# EasyEDA schematic Schematic.json
TITLE: Arduboy Clone; REV: 1.0; Date: 2017-06-03; Sheet: 1/1; Drawn By: Amal Shajan
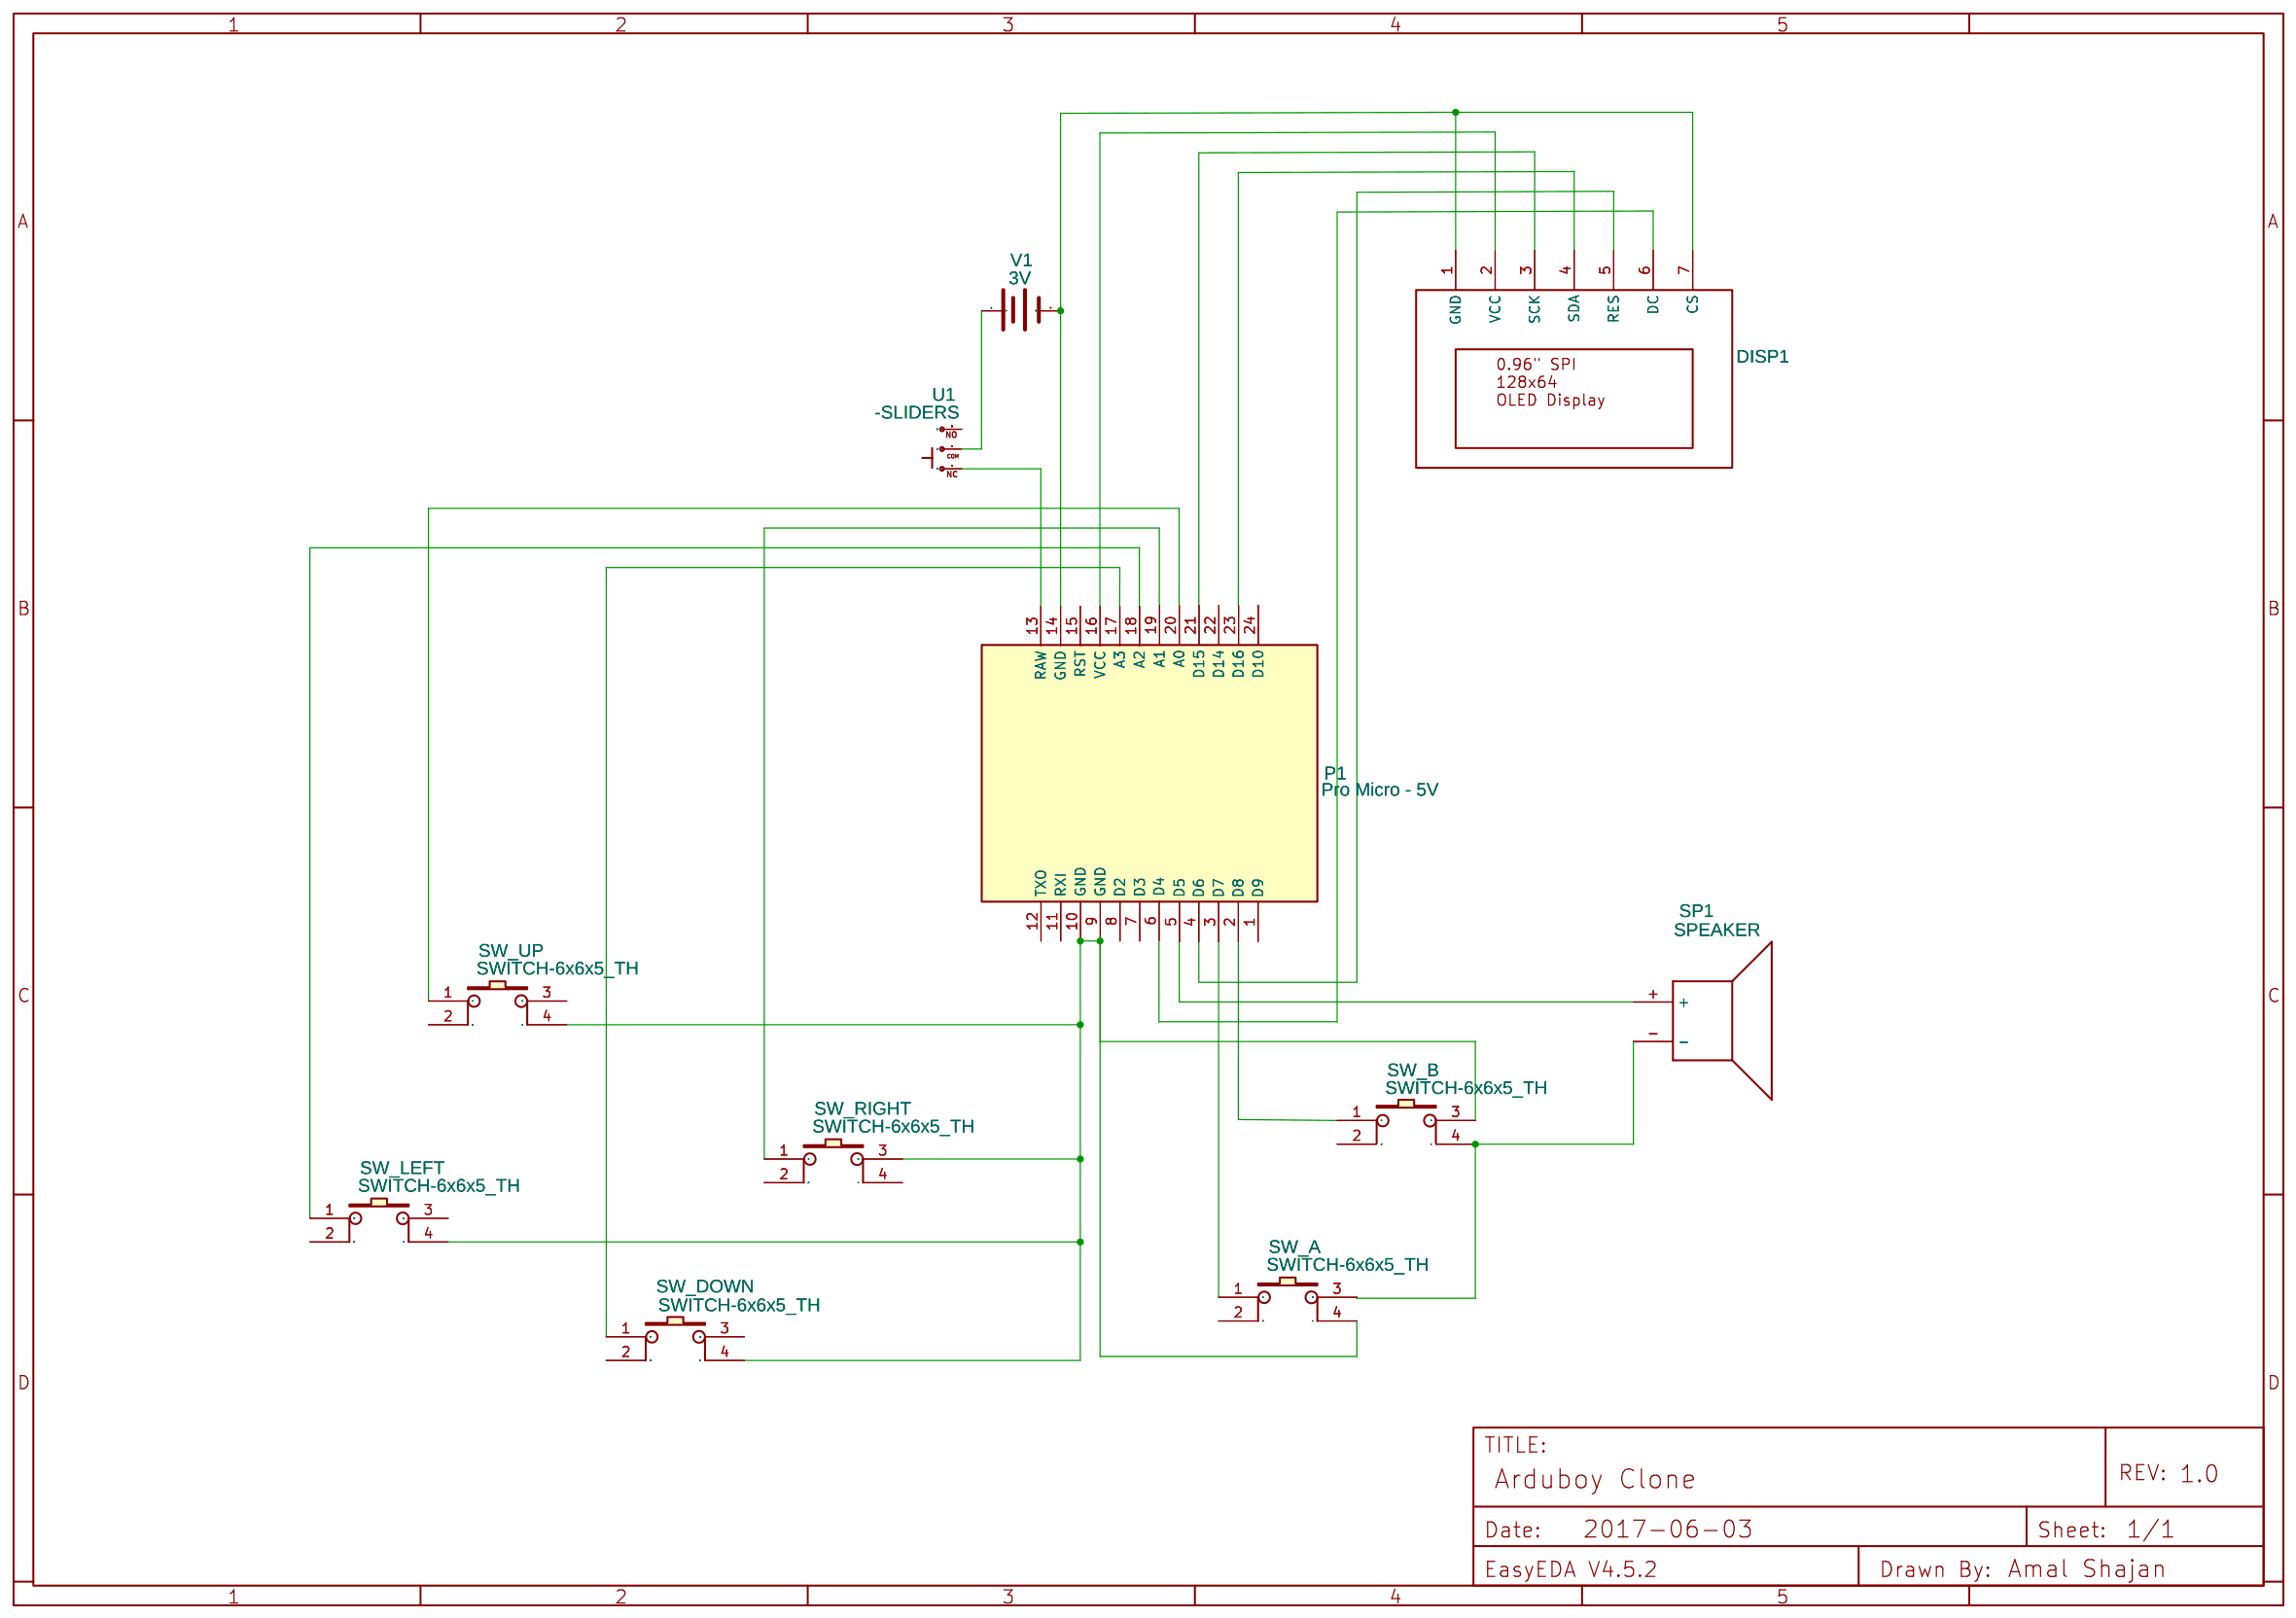
[diagram p0: schematic sheet]

## Parts
DISP1  NO  [7pin SPI color OLED Display]
P1  Pro Micro - 5V  [Pro Micro - 5V]
SP1  SPEAKER  [PCB_MOUNT_SPEAKER]
SW_A  SWITCH-6x6x5_TH  [SWITCH-12X12X7.3_DIP]
SW_B  SWITCH-6x6x5_TH  [SWITCH-12X12X7.3_DIP]
SW_DOWN  SWITCH-6x6x5_TH  [SWITCH-12X12X7.3_DIP]
SW_LEFT  SWITCH-6x6x5_TH  [SWITCH-12X12X7.3_DIP]
SW_RIGHT  SWITCH-6x6x5_TH  [SWITCH-12X12X7.3_DIP]
SW_UP  SWITCH-6x6x5_TH  [SWITCH-12X12X7.3_DIP]
U1  -SLIDERS  [CON3]
V1  3V  [BATTERY-1]

## Library data of the parts
DISP1 = -: Contributor: gerdmuller.de; sourceId: YwIUSP1BN; Manufacturer Part: ?
P1 = -: catid: 20; sourceId: 1T5FDZYC8; Manufacturer Part: ?
SP1 = -: catid: 20; Contributor: SparkFun; Manufacturer Part: ?
SW_A SW_B SW_DOWN SW_LEFT SW_RIGHT SW_UP = -: EasyEDA: C69330; Supplier: EasyEDA; Manufacturer: EasyEDA
U1 = -: catid: 20; Manufacturer Part: ?
V1 = Battery: Manufacturer Part: ?

## Nets
Net-(DISP1-1): DISP1.1(GND) DISP1.7(CS) P1.14(GND) V1.2
Net-(DISP1-2): DISP1.2(VCC) P1.16(VCC)
Net-(DISP1-3): DISP1.3(SCK) P1.21(D15)
Net-(DISP1-4): DISP1.4(SDA) P1.23(D16)
Net-(DISP1-5): DISP1.5(RES) P1.4(D6)
Net-(DISP1-6): DISP1.6(DC) P1.6(D4)
Net-(P1-2): P1.2(D8) SW_B.1
Net-(P1-3): P1.3(D7) SW_A.1
Net-(P1-5): P1.5(D5) SP1.+
Net-(P1-9): P1.9(GND) P1.10(GND) SW_A.4 SW_B.3 SW_DOWN.4 SW_LEFT.4 SW_RIGHT.3 SW_UP.4
Net-(P1-13): P1.13(RAW) U1.P$1(1)
Net-(P1-17): P1.17(A3) SW_DOWN.1
Net-(P1-18): P1.18(A2) SW_LEFT.1
Net-(P1-19): P1.19(A1) SW_RIGHT.1
Net-(P1-20): P1.20(A0) SW_UP.1
Net-(SP1--): SP1.- SW_A.3 SW_B.4
Net-(U1-P$2): U1.P$2(2) V1.1

Not connected (* = marked no-connect by the designer): P1 1(D9) 7(D3) 8(D2) 11(RXI) 12(TXO) 15(RST) 22(D14) 24(D10); SW_A 2; SW_B 2; SW_DOWN 2 3; SW_LEFT 2 3; SW_RIGHT 2 4; SW_UP 2 3; U1 P$3(3)
